# Altium schematic sheet LoRa_XCVR.SchDoc
size B
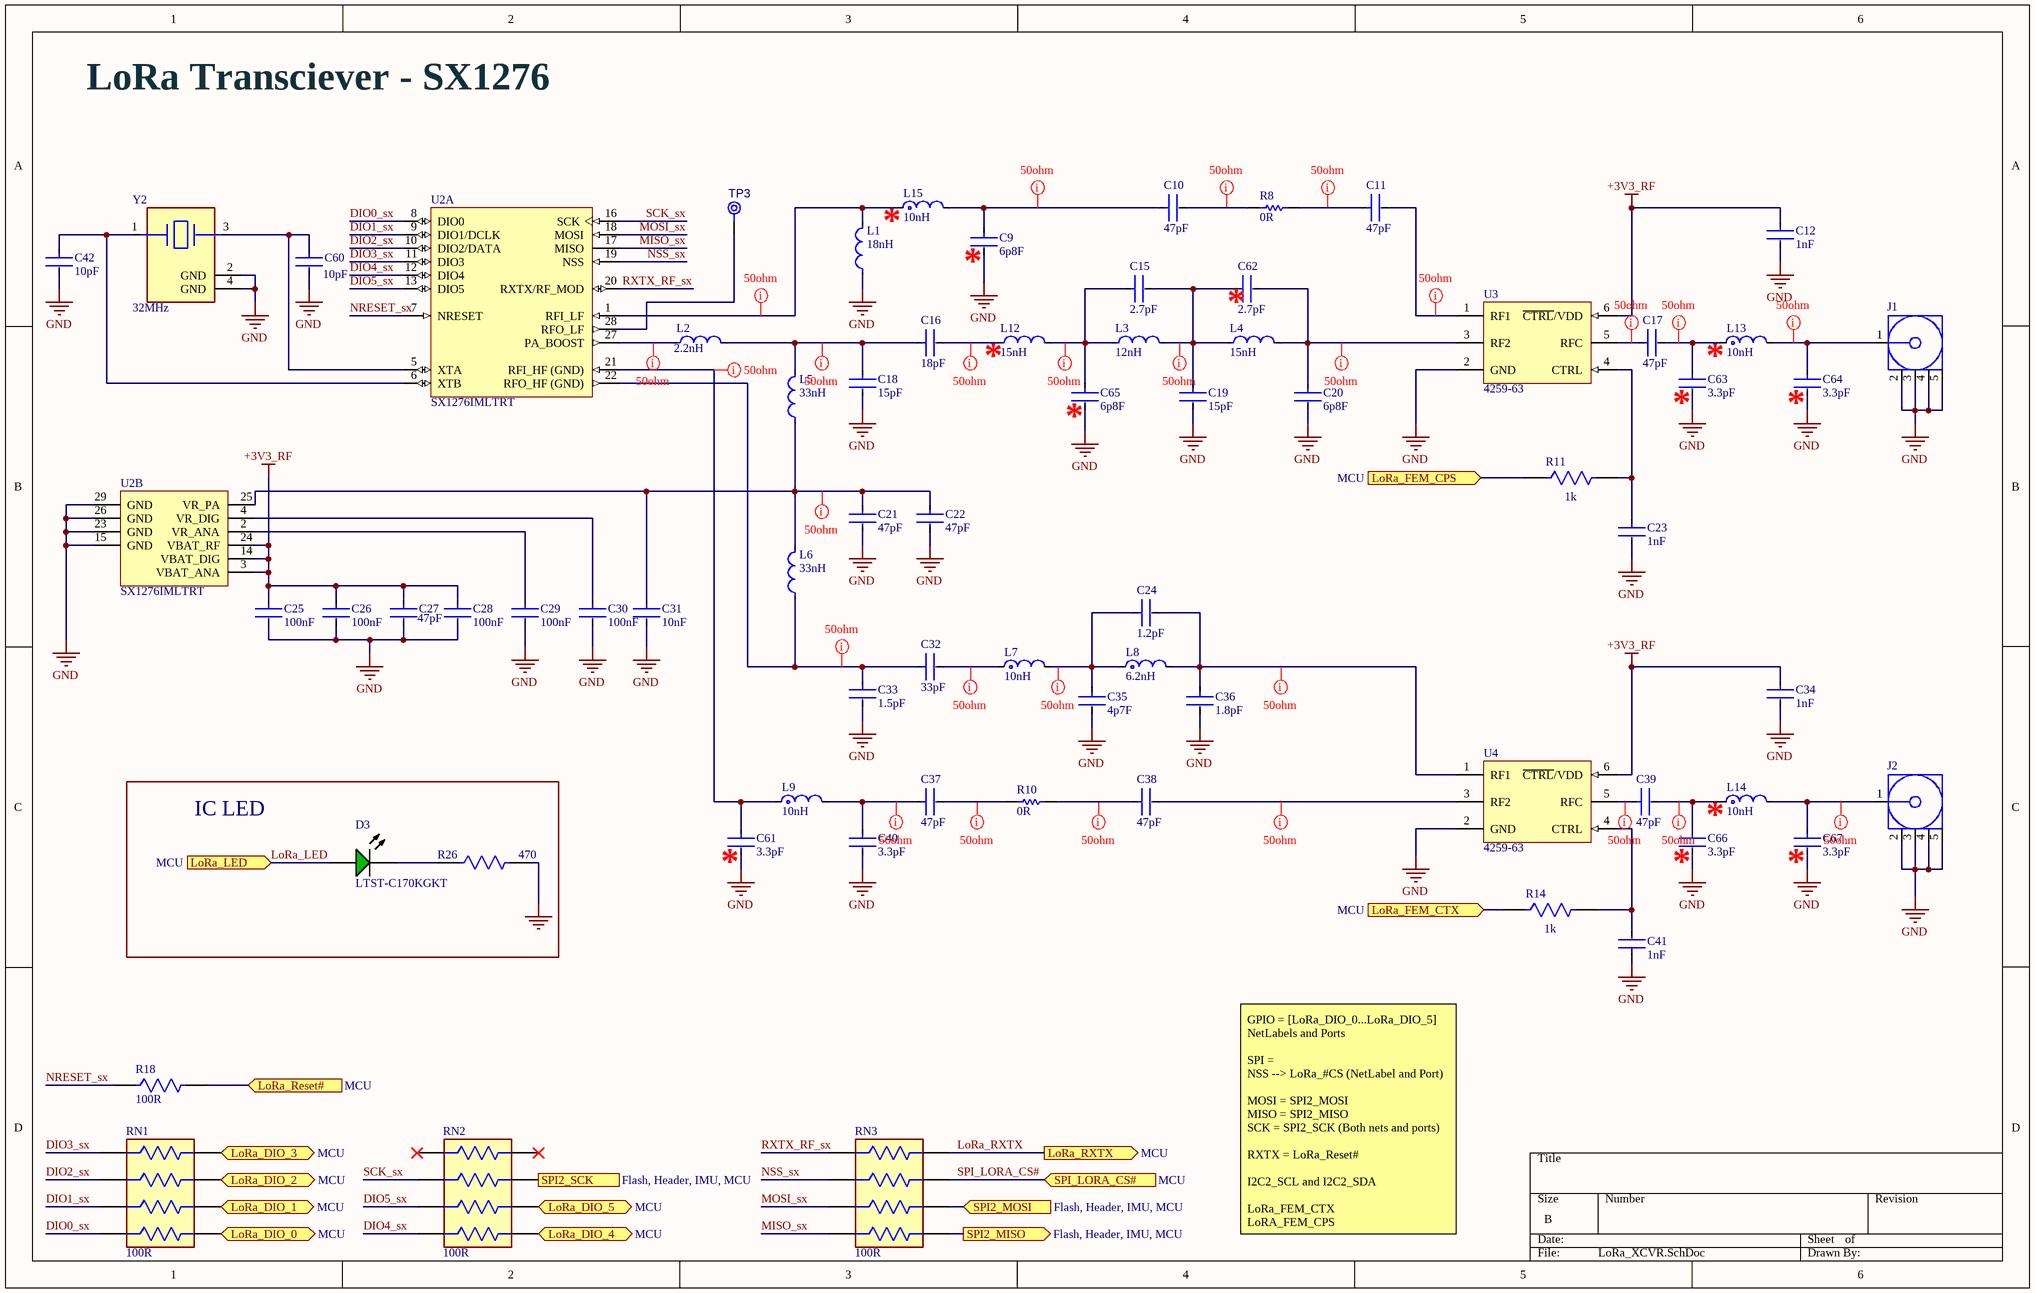
[diagram p0: LoRa_XCVR.SchDoc]

## Parts
C9  6p8F  [FP-GJM155-0_05-IPC_A]
C10  47pF  [FP-GJM155-0_05-MFG]
C11  47pF  [FP-GJM155-0_05-MFG]
C12  1nF  [FP-GRM155-0_05-IPC_C]
C15  2.7pF  [FP-GJM155-0_05-IPC_A]
C16  18pF  [FP-GJM155-0_05-IPC_B]
C17  47pF  [FP-GJM155-0_05-MFG]
C18  15pF  [FP-GJM155-0_05-IPC_A]
C19  15pF  [FP-GJM155-0_05-IPC_A]
C20  6p8F  [FP-GJM155-0_05-IPC_A]
C21  47pF  [FP-GJM155-0_05-MFG]
C22  47pF  [FP-GJM155-0_05-MFG]
C23  1nF  [FP-GRM155-0_05-IPC_C]
C24  1.2pF  [FP-GJM155-0_05-IPC_B]
C25  100nF  [FP-GRM155-0_05-IPC_B]
C26  100nF  [FP-GRM155-0_05-IPC_B]
C27  47pF  [FP-GJM155-0_05-MFG]
C28  100nF  [FP-GRM155-0_05-IPC_B]
C29  100nF  [FP-GRM155-0_05-IPC_B]
C30  100nF  [FP-GRM155-0_05-IPC_B]
C31  10nF  [FP-GRM155-0_05-IPC_C]
C32  33pF  [FP-GJM155-0_05-MFG]
C33  1.5pF  [FP-GJM155-0_05-IPC_C]
C34  1nF  [FP-GRM155-0_05-IPC_C]
C35  4p7F  [FP-GJM155-0_05-IPC_B]
C36  1.8pF  [FP-GJM155-0_05-IPC_B]
C37  47pF  [FP-GJM155-0_05-MFG]
C38  47pF  [FP-GJM155-0_05-MFG]
C39  47pF  [FP-GJM155-0_05-MFG]
C40  3.3pF  [FP-GJM155-0_05-IPC_C]
C41  1nF  [FP-GRM155-0_05-IPC_C]
C42  10pF  [FP-GRT155-0_05-MFG]
C60  10pF  [FP-GRT155-0_05-MFG]
C61  3.3pF  [FP-GJM155-0_05-IPC_C]
C62  2.7pF  [FP-GJM155-0_05-IPC_A]
C63  3.3pF  [FP-GJM155-0_05-IPC_C]
C64  3.3pF  [FP-GJM155-0_05-IPC_C]
C65  6p8F  [FP-GJM155-0_05-IPC_A]
C66  3.3pF  [FP-GJM155-0_05-IPC_C]
C67  3.3pF  [FP-GJM155-0_05-IPC_C]
D3  LTST-C170KGKT  [LTST-LTST-C170KGKT-2_V]
J1  142-0701-801  [CINC-142-0701-801_V]  (value not drawn)
J2  142-0701-801  [CINC-142-0701-801_V]  (value not drawn)
L1  18nH  [FP-LQW15AN_00-W0_6-0_1-MFG]
L2  2.2nH  [FP-LQW15AN_00-W0_6-0_1-MFG]
L3  12nH  [FP-LQW15AN_00-W0_6-0_1-MFG]
L4  15nH  [FP-LQW15AN_00-W0_6-0_1-MFG]
L5  33nH  [FP-LQW15AN_00-W0_5-0_1-MFG]
L6  33nH  [FP-LQW15AN_00-W0_5-0_1-MFG]
L7  10nH  [FP-LQG15HH_02-IPC_A]
L8  6.2nH  [FP-LQG15HH_02-IPC_C]
L9  10nH  [FP-LQG15HH_02-IPC_A]
L12  15nH  [FP-LQW15AN_00-W0_6-0_1-MFG]
L13  10nH  [FP-LQG15HH_02-IPC_A]
L14  10nH  [FP-LQG15HH_02-IPC_A]
L15  10nH  [FP-LQG15HH_02-IPC_A]
R8  0R  [RESC1005X40X25LL05T05]
R10  0R  [RESC1005X40X25LL05T05]
R11  1k  [FP-CRCW0402-e3-MFG]
R14  1k  [FP-CRCW0402-e3-MFG]
R18  100R  [FP-CRCW0402-e3-IPC_A]
R26  470  [FP-CPF0603-MFG]
RN1  100R  [FP-EXB38V-MFG]
RN2  100R  [FP-EXB38V-MFG]
RN3  100R  [FP-EXB38V-MFG]
TP3  TPAD6R  [TP06R]  (value not drawn)  (no BOM)
U2  SX1276IMLTRT  [SMTC-QFN-28_V]  (parts A,B of 2)
U3  4259-63  [PERE-SC-70-6_M]
U4  4259-63  [PERE-SC-70-6_M]
Y2  32MHz  [FP-ABM11-MFG]

## Blocks framed on the sheet
IC LED: D3 R26

## Ports
LoRa_DIO_0 (bidir, see MCU), LoRa_DIO_1 (bidir, see MCU), LoRa_DIO_2 (bidir, see MCU), LoRa_DIO_3 (bidir, see MCU), LoRa_DIO_4 (bidir, see MCU), LoRa_DIO_5 (bidir, see MCU), LoRa_FEM_CPS (in, see MCU), LoRa_FEM_CTX (in, see MCU), LoRa_LED (in, see MCU), LoRa_Reset# (in, see MCU), LoRa_RXTX (out, see MCU), SPI2_MISO (out, see Flash, Header, IMU, MCU), SPI2_MOSI (in, see Flash, Header, IMU, MCU), SPI2_SCK (in, see Flash, Header, IMU, MCU), SPI_LORA_CS# (in, see MCU)

## Nets
+3V3_RF: C12.1 C25.1 C26.1 C27.1 C28.1 C34.1 U2.3(VBAT_ANA) U2.14(VBAT_DIG) U2.24(VBAT_RF) U3.6(~{CTRL}/VDD) U4.6(~{CTRL}/VDD)
GND: C9.2 C12.2 C18.2 C19.2 C20.2 C21.2 C22.2 C23.2 C25.2 C26.2 C27.2 C28.2 C29.2 C30.2 C31.2 C33.2 C34.2 C35.2 C36.2 C40.2 C41.1 C42.2 C60.2 C61.2 C63.2 C64.2 C65.2 C66.2 C67.2 J1.2 J1.3 J1.4 J1.5 J2.2 J2.3 J2.4 J2.5 L1.1 R26.2 U2.15(GND) U2.23(GND) U2.26(GND) U2.29(GND) U3.2(GND) U4.2(GND) Y2.2(GND) Y2.4(GND)
DIO0_sx: RN1.4 U2.8(DIO0)
DIO1_sx: RN1.3 U2.9(DIO1/DCLK)
DIO2_sx: RN1.2 U2.10(DIO2/DATA)
DIO3_sx: RN1.1 U2.11(DIO3)
DIO4_sx: RN2.4 U2.12(DIO4)
DIO5_sx: RN2.3 U2.13(DIO5)
LoRa_DIO_0: RN1.5 ; port LoRa_DIO_0
LoRa_DIO_1: RN1.6 ; port LoRa_DIO_1
LoRa_DIO_2: RN1.7 ; port LoRa_DIO_2
LoRa_DIO_3: RN1.8 ; port LoRa_DIO_3
LoRa_DIO_4: RN2.5 ; port LoRa_DIO_4
LoRa_DIO_5: RN2.6 ; port LoRa_DIO_5
LoRa_FEM_CPS: R11.1 ; port LoRa_FEM_CPS
LoRa_FEM_CTX: R14.1 ; port LoRa_FEM_CTX
LoRa_LED: D3.2(A) ; port LoRa_LED
LoRa_Reset#: R18.2 ; port LoRa_Reset#
LoRa_RXTX: RN3.8 ; port LoRa_RXTX
MISO_sx: RN3.4 U2.17(MISO)
MOSI_sx: RN3.3 U2.18(MOSI)
NRESET_sx: R18.1 U2.7(NRESET)
NSS_sx: RN3.2 U2.19(NSS)
RXTX_RF_sx: RN3.1 U2.20(RXTX/RF_MOD)
SCK_sx: RN2.2 U2.16(SCK)
SPI2_MISO: RN3.5 ; port SPI2_MISO
SPI2_MOSI: RN3.6 ; port SPI2_MOSI
SPI2_SCK: RN2.7 ; port SPI2_SCK
SPI_LORA_CS#: RN3.7 ; port SPI_LORA_CS#
NetC9_1: C9.1 C10.1 L15.2
NetC10_2: C10.2 R8.1
NetC11_1: C11.1 R8.2
NetC11_2: C11.2 U3.1(RF1)
NetC15_1: C15.1 C65.1 L3.1 L12.2
NetC15_2: C15.2 C19.1 C62.1 L3.2 L4.1
NetC16_1: C16.1 C18.1 L2.2 L5.2
NetC16_2: C16.2 L12.1
NetC17_1: C17.1 U3.5(RFC)
NetC17_2: C17.2 C63.1 L13.1
NetC20_1: C20.1 C62.2 L4.2 U3.3(RF2)
NetC21_1: C21.1 C22.1 C31.1 L5.1 L6.2 U2.25(VR_PA)
NetC23_1: C23.1 R11.2 U3.4(CTRL)
NetC24_1: C24.1 C35.1 L7.2 L8.1
NetC24_2: C24.2 C36.1 L8.2 U4.1(RF1)
NetC29_1: C29.1 U2.2(VR_ANA)
NetC30_1: C30.1 U2.4(VR_DIG)
NetC32_1: C32.1 C33.1 L6.1 U2.22(RFO_HF_(GND))
NetC32_2: C32.2 L7.1
NetC37_1: C37.1 C40.1 L9.2
NetC37_2: C37.2 R10.1
NetC38_1: C38.1 R10.2
NetC38_2: C38.2 U4.3(RF2)
NetC39_1: C39.1 U4.5(RFC)
NetC39_2: C39.2 C66.1 L14.1
NetC41_2: C41.2 R14.2 U4.4(CTRL)
NetC42_1: C42.1 U2.6(XTB) Y2.1
NetC60_1: C60.1 U2.5(XTA) Y2.3
NetC61_1: C61.1 L9.1 U2.21(RFI_HF_(GND))
NetC64_1: C64.1 J1.1 L13.2
NetC67_1: C67.1 J2.1 L14.2
NetD3_1: D3.1(K) R26.1
NetL1_2: L1.2 L15.1 U2.1(RFI_LF)
NetL2_1: L2.1 U2.27(PA_BOOST)
NetTP3_1: TP3.1(TP) U2.28(RFO_LF)

Not connected (* = marked no-connect by the designer): RN2 1* 8*

## Layout directives
net class 50ohm: NetC9_1, NetC10_2, NetC11_1, NetC11_2, NetC15_1, NetC15_2, NetC16_1, NetC16_2, NetC17_1, NetC17_2, NetC20_1, NetC21_1, NetC24_1, NetC24_2, NetC32_1, NetC32_2, NetC37_1, NetC37_2, NetC38_1, NetC38_2, NetC39_1, NetC39_2, NetC61_1, NetC64_1, NetC67_1, NetL1_2, NetL2_1

## Notes on the sheet
- LoRa Transciever - SX1276
- (near L15) *
- (near C9) *
- (near L12) *
- (near C62) *
- (near L13) *
- (near C65) *
- (near C63) *
- (near C64) *
- (near L14) *
- (near C61) *
- (near C66) *
- (near C67) *
- GPIO = [LoRa_DIO_0...LoRa_DIO_5] NetLabels and Ports
  SPI =
  NSS --> LoRa_#CS (NetLabel and Port)
  MOSI = SPI2_MOSI
  MISO = SPI2_MISO
  SCK = SPI2_SCK (Both nets and ports)
  RXTX = LoRa_Reset#
  I2C2_SCL and I2C2_SDA
  LoRa_FEM_CTX
  LoRA_FEM_CPS

## Library data of the parts
C9 C20 C65 = CMP-2008-03772-2: Multi-Layer Ceramic Capacitor 6.8pF C0G  ±0.1pF 0402 Paper T/R; Voltage Rating (DC): 50V; Dielectric: C0G; Mount: Surface Mount; Packaging: Tape and Reel; Capacitance: 6.8pF; Length: 1mm; Height: 0.5mm; Depth: 0.5mm; Thickness: 0.022inch; Max Operating Temperature: 125°C; Package Quantity: 10000; Width: 0.02inch; Case Code (Metric): 1005; Lead Free: Lead Free; Termination: SMD/SMT; Case Code (Imperial): 0402; Radiation Hardening: No; Case/Package: 0402; Voltage Rating: 50V; Min Operating Temperature: -55°C
C10 C11 C17 C21 C22 C27 C37-C39 = CMP-06035-013708-1: Multi-Layer Ceramic Capacitor 47pF C0G  ±5% 0402 Paper T/R; Voltage Rating (DC): 50V; Capacitance: 47pF; Tolerance: 5%; Dielectric: C0G; Thickness: 500um; Length: 1mm; Width: 500um
C12 C23 C34 C41 = CMP-1034-01633-3: Chip Multilayer Ceramic Capacitors for General Purpose, 0402, 1000pF, X7R, 15%, 10%, 100V; Width: 0.5mm; Radiation Hardening: No; Min Operating Temperature: -55°C; Lead Free: Lead Free; Voltage Rating: 100V; Max Operating Temperature: 125°C; Case Code (Imperial): 0402; Case/Package: 0402; Depth: 0.5mm; Case Code (Metric): 1005; Capacitance: 1nF; Height: 0.5mm; Termination: SMD/SMT; Thickness: 0.022inch; Material: Ceramic; Dielectric: X7R; Package Quantity: 10000; Tolerance: 10%; Packaging: Tape and Reel; Length: 1mm; REACH SVHC: No SVHC; Voltage: 100V; Mount: Surface Mount; Voltage Rating (DC): 100V
C15 C62 = CMP-2008-03840-2: Multi-Layer Ceramic Capacitor 2.7pF C0G  ±0.1pF 0402 Paper T/R; Voltage Rating (DC): 50V; Temperature Coefficient: 30ppm/°C; Max Operating Temperature: 125°C; Lead Free: Lead Free; REACH SVHC: No SVHC; Thickness: 0.022inch; Length: 1mm; Height: 0.5mm; Min Operating Temperature: -55°C; Mount: Surface Mount; Case/Package: 0402; Case Code (Imperial): 0402; Width: 0.02inch; Capacitance: 2.7pF; Packaging: Tape and Reel; Package Quantity: 10000; Lead Pitch: 0.3mm; Dielectric: C0G; Depth: 0.5mm; Voltage Rating: 50V; Radiation Hardening: No; Termination: SMD/SMT; Voltage: 50V; Number of Pins: 2; Case Code (Metric): 1005
C16 = CMP-2008-03807-2: Multi-Layer Ceramic Capacitor 18pF C0G  ±5% 0402 Paper T/R; Voltage: 50V; Radiation Hardening: No; Capacitance: 18pF; Depth: 0.5mm; Voltage Rating: 50V; Case/Package: 0402; Tolerance: 5%; Packaging: Tape and Reel; Height: 0.5mm; Case Code (Imperial): 0402; Width: 0.02inch; Lead Free: Lead Free; Dielectric: C0G; Package Quantity: 1; Max Operating Temperature: 125°C; Thickness: 0.022inch; Termination: SMD/SMT; Length: 1mm; Min Operating Temperature: -55°C; Mount: Surface Mount; Voltage Rating (DC): 50V; Case Code (Metric): 1005
C18 C19 = CMP-2008-03804-2: Multi-Layer Ceramic Capacitor 15pF C0G  ±5% 0402 Paper T/R; Voltage Rating (DC): 50V; Temperature Coefficient: 30ppm/°C; Dielectric: C0G; Max Operating Temperature: 125°C; Radiation Hardening: No; REACH SVHC: No SVHC; Case Code (Imperial): 0402; Package Quantity: 1; Thickness: 0.022inch; Min Operating Temperature: -55°C; Mount: Surface Mount; Tolerance: 5%; Voltage Rating: 50V; Depth: 0.5mm; Width: 0.02inch; Height: 0.5mm; Number of Pins: 2; Case Code (Metric): 1005; Lead Pitch: 0.3mm; Case/Package: 0402; Termination: SMD/SMT; Voltage: 50V; Length: 1mm; Capacitance: 15pF; Packaging: Tape and Reel; Lead Free: Lead Free
C24 = CMP-2008-03813-2: Multi-Layer Ceramic Capacitor 1.2pF C0G  ±0.1pF 0402 Paper T/R; Voltage Rating (DC): 50V; Temperature Coefficient: 30ppm/°C; Case Code (Metric): 1005; Lead Free: Lead Free; Packaging: Tape and Reel; Radiation Hardening: No; Dielectric: C0G; Case Code (Imperial): 0402; Weight: 2.3E-05oz; Width: 0.5mm; Case/Package: 0402; Length: 1mm; Voltage Rating: 50V; Number of Pins: 2; Depth: 0.5mm; Thickness: 0.022inch; Voltage: 50V; Package Quantity: 10000; Max Operating Temperature: 125°C; Height: 0.5mm; REACH SVHC: No SVHC; Capacitance: 1.2pF; Mount: Surface Mount; Min Operating Temperature: -55°C; Termination: SMD/SMT; Lead Pitch: 0.3mm
C25 C26 C28-C30 = CMP-2008-04639-2: Chip Multilayer Ceramic Capacitors for General Purpose, 0402, 0.10uF, X7R, 15%, 10%, 50V; Dissipation Factor: 0.025%; Weight: 0.000212oz; Thickness: 0.022inch; Voltage Rating (DC): 50V; Dielectric Material: Ceramic; Termination: SMD/SMT; Case/Package: 0402; Case Code (Imperial): 0402; Mount: Surface Mount; REACH SVHC: No SVHC; Resistor Type: Ceramic; Dielectric: X7R; Max Operating Temperature: 125°C; Voltage: 50V; Lead Free: Lead Free; Package Quantity: 10000; Packaging: Tape and Reel; Capacitance: 100nF; Length: 1mm; Material: Ceramic; Height: 0.5mm; Depth: 0.5mm; Width: 0.5mm; Min Operating Temperature: -55°C; Tolerance: 10%; Case Code (Metric): 1005; Voltage Rating: 50V
C31 = CMP-2008-04637-5: Chip Multilayer Ceramic Capacitors for General Purpose, 0402, 10000pF, X7R, 15%, 10%, 50V; Voltage: 25V; Tolerance: 10%; Mount: Surface Mount; Lead Free: Lead Free; Radiation Hardening: No; Case Code (Imperial): 0402; REACH SVHC: No SVHC; Case/Package: 0402; Dielectric: X7R; Voltage Rating (DC): 50V; Max Operating Temperature: 125°C; Termination: SMD/SMT; Material: Ceramic; Width: 0.02inch; Package Quantity: 1; Voltage Rating: 50V; Thickness: 0.022inch; Packaging: Tape and Reel; Height: 0.5mm; Number of Pins: 2; Case Code (Metric): 1005; Min Operating Temperature: -55°C; Length: 1mm; Capacitance: 10nF; Depth: 0.5mm
C32 = CMP-06035-057988-1: Multi-Layer Ceramic Capacitor 33pF C0G  ±5% 0402 Paper T/R; Voltage Rating (DC): 50V; Width: 500um; Capacitance: 33pF; Dielectric: C0G; Length: 1mm; Thickness: 500um; Tolerance: 5%
C33 = CMP-2008-03820-2: Multi-Layer Ceramic Capacitor 1.5pF C0G  ±0.1pF 0402 Paper T/R; Temperature Coefficient: 30ppm/°C; Voltage Rating: 50V; Depth: 0.5mm; Case Code (Imperial): 0402; Package Quantity: 10000; Length: 1mm; Number of Pins: 2; Max Operating Temperature: 125°C; Mount: Surface Mount; Construction: Flat; Thickness: 0.022inch; Series: GJM; Packaging: Tape and Reel; Radiation Hardening: No; REACH SVHC: No SVHC; Case/Package: 0402; Lead Free: Lead Free; Voltage Rating (DC): 50V; Min Operating Temperature: -55°C; Dielectric: C0G; Termination: SMD/SMT; Width: 0.5mm; Capacitance: 1.5pF; Lead Pitch: 0.3mm; Case Code (Metric): 1005; Voltage: 50V; Height: 0.5mm
C35 = CMP-2008-03859-2: Multi-Layer Ceramic Capacitor 4.7pF C0G  ±0.25pF 0402 Paper T/R; Voltage Rating (DC): 50V; Temperature Coefficient: 30ppm/°C; Case/Package: 0402; Packaging: Tape and Reel; Package Quantity: 10000; Depth: 0.5mm; REACH SVHC: No SVHC; Height: 0.5mm; Lead Free: Lead Free; Number of Pins: 2; Case Code (Imperial): 0402; Width: 0.02inch; Max Operating Temperature: 125°C; Capacitance: 4.7pF; Dielectric: C0G; Lead Pitch: 0.3mm; Voltage Rating: 50V; Min Operating Temperature: -55°C; Thickness: 0.022inch; Voltage: 50V; Radiation Hardening: No; Mount: Surface Mount; Termination: SMD/SMT; Case Code (Metric): 1005; Length: 1mm
C36 = CMP-2008-03825-2: Multi-Layer Ceramic Capacitor 1.8pF C0G  ±0.1pF 0402 Paper T/R; Voltage: 50V; Dielectric: C0G; Number of Pins: 2; Depth: 0.5mm; Case Code (Imperial): 0402; Max Operating Temperature: 125°C; Radiation Hardening: No; Width: 0.5mm; Thickness: 0.022inch; REACH SVHC: No SVHC; Mount: Surface Mount; Voltage Rating (DC): 50V; Case/Package: 0402; Length: 1mm; Case Code (Metric): 1005; Capacitance: 1.8pF; Packaging: Tape and Reel; Min Operating Temperature: -55°C; Termination: SMD/SMT; Lead Pitch: 0.3mm; Lead Free: Lead Free; Voltage Rating: 50V; Height: 0.5mm; Package Quantity: 10000
C40 C61 C63 C64 C66 C67 = CMP-2008-03846-2: Multi-Layer Ceramic Capacitor 3.3pF C0G  ±0.1pF 0402 Paper T/R; Voltage: 50V; Lead Free: Lead Free; Thickness: 0.022inch; Mount: Surface Mount; Termination: SMD/SMT; Package Quantity: 1; Lead Pitch: 0.3mm; Case/Package: 0402; REACH SVHC: No SVHC; Case Code (Imperial): 0402; Number of Pins: 2; Height: 0.5mm; Width: 0.5mm; Depth: 0.5mm; Capacitance: 3.3pF; Packaging: Tape and Reel; Min Operating Temperature: -55°C; Length: 1mm; Dielectric: C0G; Case Code (Metric): 1005; Max Operating Temperature: 125°C; Voltage Rating (DC): 50V; Voltage Rating: 50V; Radiation Hardening: No
C42 C60 = CMP-06035-051459-1: Multi-Layer Ceramic Capacitor 10pF 50V C0G ±5% 0402 Paper T/R
D3 = CMP-2000-06620-1: Ultra Bright AlInGaP Chip LED, 75 mW, -55 to 85 degC, 2-Pin SMD (0805), RoHS, Tape and Reel; Manufacturer: Lite-On; Forward Current: 30mA; Power Dissipation Max: 75mW; Emitting Color: YellowGreen; Type: Uni-Color; Forward Voltage: 2.4V; Dominant Wave Length: 571nm; Test Current (It): 20mA; Product Length (mm): 2mm; Peak Wavelength: 574nm; Power Dissipation: 75W; Product Depth (mm): 1.25mm; DELETED: Compliant; High Brightness: Yes; Product Height (mm): 1.1mm; Luminous Intensity: 35mcd; Shape Type: Rectangular; Chip Material: AlGaInP; Viewing Angle: 130deg; Number of  Elements: 1; Reverse Voltage: 5V; Rad Hardened: No; Package Type: ChipLed; Manufacturer URL: http://www.us.liteon.com/; Mounting: SurfaceMount; Operating Temp Range: -55Cto85C; Datasheet URL: http://optoelectronics.liteon.com/upload/download/DS22-2000-073/S_110_LTST-C170KGKT.pdf; Packaging: TapeandReel; Pin Count: 2; Package Description: 2-Pin Surface Mounted Device, Body 2 x 1.25 mm; Mounting Technology: SurfaceMount; Package Reference: LTST-C170KGKT-2; Forward Current Max: 30mA; Datasheet Version: Rev. G, 06/2005; Lens Dimensions: 1.4x1.25x0.6mm; Operating Temperature Classification: Industrial; Lum Intensity: 35mcd; Main Category: ChipLED
J1 J2 = CMP-2000-05490-1: SMA End Launch Jack Receptacle, 50 Ohm, 0 to 18 GHz, -65 to 165 degC, 5-Pin SMD, RoHS, Bulk; Manufacturer: EmersonConnectivitySolutions; Connector Type: JackPCB; Gender: Jack(Female); Impedance: 50Ohms; Brand: Johnson/EmersonConnectivitySolutions; Body Material: Brass; Body Style: Straight; Maximum Frequency: 18GHz; Factory Pack Quantity: 5; Datasheet URL: https://belfuse.com/resources/Johnson/productinformation/pi-142-0701-801.pdf; Datasheet Version: 12/2014; Operating Temperature Range: -65Cto+165C; Mounting Technology: SurfaceMount; RF Series: SMA; Package Reference: 142-0701-801; Product Category: RFConnectors/CoaxialConnectors; Termination Style: Solder; RoHS: Details; Package URL: https://belfuse.com/resources/Johnson/drawings/dr-1420701801.pdf; Series: SMA; Package Description: 5-Pin Surface Mount Device, Body 14.275 x 9.525 mm; Manufacturer URL: http://www.cinch.com/; Contact Plating: Gold; Product: Connectors; Orientation: Straight
L1 = CMP-06042-006916-1: Wire Wound RF Inductor 18nH ±5% 370mA 0.27Ω 0402 (1005); Q Factor: 25; DC Resistance (DCR): 270mR; Test Frequency: 100MHz; Self Resonant Frequency: 4.5GHz; Core Material: Air; Shielding: Unshielded; Inductance: 18nH; Lead Free: Lead Free; Resistor Type: Wirewound; Height: 0.5mm; Width: 0.02inch; Max DC Current: 370mA; Case/Package: 0402; Radiation Hardening: No; Min Operating Temperature: -55°C; Packaging: Tape and Reel; DC Current: 370mA; Tolerance: 5%; Max Operating Temperature: 125°C; Weight: 2.8E-05oz; Current Rating: 370mA; Military Standard: Not; Termination: SMD/SMT; Length: 1mm; Case Code (Metric): 1005; Mount: Surface Mount; Case Code (Imperial): 0402; Package Quantity: 10000; Depth: 0.7mm
L2 = CMP-06042-008786-1: Wire Wound RF Inductor 2.2nH ±0.2nH 1000mA 0.027Ω 0402 (1005); Q Factor: 25; Current Rating: 1A; Core Material: Air; Test Frequency: 100MHz; Shielding: Unshielded; DC Resistance (DCR): 27mR; Self Resonant Frequency: 14GHz; Min Operating Temperature: -55°C; Package Quantity: 10000; Length: 1mm; Number of Pins: 2; Radiation Hardening: No; Case Code (Metric): 1005; Termination: SMD/SMT; Inductance: 2.2nH; Mount: Surface Mount; DC Current: 1A; Military Standard: Not; Max Operating Temperature: 125°C; Max DC Current: 1A; Lead Free: Lead Free; Depth: 0.7mm; Case/Package: 0402; Packaging: Tape and Reel; Height: 0.5mm; Width: 0.5mm; REACH SVHC: No SVHC; Weight: 2.8E-05oz; Case Code (Imperial): 0402
L3 = CMP-06042-005424-1: Wire Wound RF Inductor 12nH ±5% 500mA 0.14Ω 0402 (1005); Shielding: Unshielded; Self Resonant Frequency: 5.5GHz; Core Material: Air; Test Frequency: 100MHz; Q Factor: 30; DC Resistance (DCR): 140mR; DC Current: 500mA; Case/Package: 0402; Max DC Current: 500mA; Current Rating: 500mA; Mount: Surface Mount; Case Code (Metric): 1005; Military Standard: Not; Inductance: 12nH; Min Operating Temperature: -55°C; Packaging: Tape and Reel; Radiation Hardening: No; Package Quantity: 10000; Max Operating Temperature: 125°C; Resistor Type: Wirewound; Case Code (Imperial): 0402; Tolerance: 5%; Lead Free: Lead Free; Termination: SMD/SMT; Length: 1.1mm; Height: 0.02inch; Depth: 0.7mm; Weight: 2.8E-05oz; Width: 0.5mm
L4 L12 = CMP-2000-06595-2: Wire Wound RF Inductor 15nH ±5% 460mA 0.16Ω 0402 (1005); Test Frequency: 100MHz; DC Resistance (DCR): 160mR; Shielding: Unshielded; Q Factor: 30; Core Material: Air; Self Resonant Frequency: 5GHz; Resistor Type: Wirewound; DC Current: 460mA; Inductance: 15nH; Weight: 2.8E-05oz; Radiation Hardening: No; Depth: 0.7mm; Package Quantity: 10000; Case/Package: 0402; Packaging: Tape and Reel; Length: 1mm; Max DC Current: 460mA; Case Code (Imperial): 0402; Tolerance: 5%; Min Operating Temperature: -55°C; Lead Free: Lead Free; Width: 0.02inch; Case Code (Metric): 1005; Termination: SMD/SMT; Military Standard: Not; Current Rating: 460mA; Height: 0.5mm; Mount: Surface Mount; Max Operating Temperature: 125°C
L5 L6 = CMP-06042-007456-1: Wire Wound RF Inductor 33nH ±5% 260mA 0.63Ω 0402 (1005); Test Frequency: 100MHz; Core Material: Air; Shielding: Unshielded; Q Factor: 25; Self Resonant Frequency: 3.2GHz; DC Resistance (DCR): 630mR; Width: 0.5mm; Tolerance: 5%; Case Code (Imperial): 0402; Max Operating Temperature: 125°C; Inductance: 33nH; Weight: 2.8E-05oz; Case Code (Metric): 1005; Lead Free: Lead Free; Case/Package: 0402; Max DC Current: 260mA; Military Standard: Not; Length: 1mm; Packaging: Tape and Reel; Mount: Surface Mount; Package Quantity: 10000; Min Operating Temperature: -55°C; Resistor Type: Wirewound; Radiation Hardening: No; Height: 0.5mm; Termination: SMD/SMT; DC Current: 260mA; Current Rating: 260mA; Depth: 0.6mm
L7 L9 L13-L15 = CMP-06042-014117-1: Multilayer type RF Inductor 10nH ±5% 0.26Ω 500mA 0402; DC Resistance (DCR): 260mR; DC Current: 300mA; Shielding: Unshielded; Q Factor: 8; Test Frequency: 100MHz; Self Resonant Frequency: 3.4GHz; Core Material: Air; Width: 0.5mm; Radiation Hardening: No; Packaging: Tape and Reel; Lead Free: Lead Free; Military Standard: Not; Case/Package: 0402; Current Rating: 300mA; Case Code (Metric): 1005; Length: 0.039inch; Termination: SMD/SMT; Max DC Current: 300mA; Max Operating Temperature: 125°C; Mount: Surface Mount; Height - Seated (Max): 0.022inch; Package Quantity: 10000; Height: 0.5mm; Inductance: 10nH; Tolerance: 5%; Case Code (Imperial): 0402; Depth: 0.55mm; Min Operating Temperature: -55°C
L8 = CMP-06042-008294-1: Multilayer type RF Inductor 6.2nH ±0.3nH 0.2Ω 600mA 0402; Current Rating: 300mA; DC Resistance (DCR): 220mR; Shielding: Unshielded; Q Factor: 8; Test Frequency: 100MHz; Core Material: Air; Self Resonant Frequency: 4.5GHz; Width: 0.02inch; Length: 1mm; Height - Seated (Max): 0.022inch; Inductance: 6.2nH; Min Operating Temperature: -55°C; Case Code (Imperial): 0402; Case/Package: 0402; Termination: SMD/SMT; Max Operating Temperature: 125°C; Package Quantity: 10000; Depth: 0.55mm; Radiation Hardening: No; Lead Free: Lead Free; Packaging: Tape and Reel; Max DC Current: 300mA; Height: 0.5mm; Mount: Surface Mount; Military Standard: Not; Case Code (Metric): 1005; DC Current: 300mA
R8 R10 = CMP-2000-07451-1: Chip Resistor, 0 Ohm, 0.1 W, -55 to 155 degC, 0402 (1005 Metric), RoHS, Tape and Reel; Manufacturer: Panasonic; Voltage Rating (DC): 50V; Temperature Coefficient: 600ppm/��C; Max Power Dissipation: 100mW; Resistance: 0mOhm; Tolerance: 5%; Number of Terminations: 2; Mount: SurfaceMount; Height: 0.35mm; Packaging: TapeandReel; Contact Plating: Tin; Manufacturer URL: http://www.panasonic.com/; Composition: ThickFilm; Max Operating Temperature: 155degC; REACH SVHC: NoSVHC; Case/Package: 0402; Package Reference: 402; Depth: 0.5mm; Package Description: 2-Pin Surface Mount Device, Body 1 x 0.5 mm; Datasheet URL: https://industrial.panasonic.com/cdbs/www-data/pdf/RDA0000/AOA0000C301.pdf; RoHSCompliant: True; Case Code (Imperial): 0402; Military Standard: Not; Min Operating Temperature: -55degC; Power Rating: 100mW; Datasheet Version: 03/2015; Length: 1mm; Case Code (Metric): 1005; Termination: SMD/SMT; Mounting Technology: SurfaceMount; Voltage Rating: 50V; Width: 0.02inch; Package Quantity: 1; Lead Free: LeadFree; Radiation Hardening: No
R11 R14 = CMP-1011-00074-3: RES Thick Film, 1kΩ, 5%, 0.063W, 200ppm/°C, 0402; Voltage Rating: 50V; Max Power Dissipation: 63mW; Resistance: 1kR; Tolerance: 5%; Military Standard: Not; Height: 0.016inch; Depth: 0.5mm; Width: 0.5mm; Radiation Hardening: No; Length: 1mm; Min Operating Temperature: -55°C; Max Operating Temperature: 155°C; Composition: Thick Film; Working Voltage: 50V; Packaging: Tape and Reel; Contact Plating: Tin; Temperature Coefficient: 200ppm/°C; Termination: SMD/SMT; Case/Package: 0402; Number of Terminations: 2; Mount: Surface Mount; Power Rating: 63mW; Package Quantity: 1; Case Code (Imperial): 0402; Number of Pins: 2; Features: Automotive AEC-Q200; Case Code (Metric): 1005; Weight: 2.3E-05oz
R18 = CMP-2002-08129-2: RES Thick Film, 100Ω, 5%, 0.063W, 200ppm/°C, 0402; Working Voltage: 50V; Max Power Dissipation: 63mW; Termination: SMD/SMT; Features: Automotive AEC-Q200; Radiation Hardening: No; Resistance: 100R; Contact Plating: Tin; Military Standard: Not; Case Code (Metric): 1005; Max Operating Temperature: 155°C; Width: 0.02inch; Number of Terminations: 2; Case/Package: 0402; Height: 0.016inch; Voltage Rating: 50V; Tolerance: 5%; Mount: Surface Mount; Composition: Thick Film; Length: 1mm; Power Rating: 63mW; Case Code (Imperial): 0402; Temperature Coefficient: 200ppm/°C; Min Operating Temperature: -55°C; Weight: 2.3E-05oz; Depth: 0.5mm; Package Quantity: 10000; Packaging: Tape and Reel
R26 = CMP-03211-004765-1: RES SMD 470Ω 0.1% 1/16W 0603 / CPF0603B470RE; Manufacturer: TE Connectivity; Temperature Coefficient: 25ppm/°C; Voltage Rating: 50V; Power Rating: 0.063W; Value: 470Ω; Device Class L3: Chip SMD Resistors; RoHS: TRUE; Category: Res; Device Class L2: Resistors; Series: CPF; Height: 0.55mm; Temperature: -55°C to +155°C; Temperature Range High: +155°C; Automotive: No; octopart_url: https://octopart.com/cpf0603b470re-te+connectivity-23376607; packaging: 5k Reel; ComponentLink2Description: Datasheet; Temperature Range Low: -55°C; Device Class L1: Passive Components; Ipc Land Pattern Name: RESC15580X45; Package: CPF0603; Composition: Thin Film; Manufacturer Part Number: CPF0603B470RE; Resistance: 470Ω; Octopart: https://octopart.com/cpf0603b470re-te+connectivity-23376607; Lead Free: Yes; ComponentLink2URL: https://www.te.com/commerce/DocumentDelivery/DDEController?Action=showdoc&DocId=Data+Sheet%7F1773200%7FM%7Fpdf%7FEnglish%7FENG_DS_1773200_M.pdf%7F3-1676481-2; Tolerance: 0.1%
RN1-RN3 = CMP-05421-000004-1: RES ARRAY 4 RES 100 OHM 1206; Number of Resistors: 4; Number of Terminals/Pins: 8; Voltage Rating: 50V; Resistance Tolerance: 5%; Voltage Rating (DC): 100V; Power Per Element: 62.5mW; Temperature Coefficient: 200ppm/°C; Circuit Type: Isolated; Resistance: 100R; Case Code (Metric): 3216; Max Operating Temperature: 125°C; Termination: Convex; Depth: 1.6mm; Number of Elements: 4; Mount: Surface Mount; Radiation Hardening: No; Case/Package: 1206; Number of Pins: 8; Package Quantity: 1; Contact Plating: Tin; Length: 3.2mm; REACH SVHC: No SVHC; Case Code (Imperial): 1206; Number of Contacts: 8; RoHS Compliant: Yes; Series: EXB; Terminal Pitch: 0.8mm; Tolerance: 5%; Technology: THICK FILM; Height: 0.5mm; Packaging: Tape and Reel; Military Standard: Not; Min Operating Temperature: -55°C; Width: 0.063inch; Lead Free: Lead Free
TP3 = CMP-00028-00002-2: 0.6mm round; Pins: 1
U2 = CMP-2000-05356-1: Low Power Long Range Transceiver, 137 to 1020 MHz, -40 to 85 degC, 28-Pin QFN, RoHS, Tape and Reel; Manufacturer: Semtech; Power - Output: 20dBm; Data Rate (Max): 300kbps; Sensitivity: -148dBm; Featured Product: SX1276LongRangeTransceiver; PCN Design/Specification: CopperWire25/Mar/2014; GPIO: 6; Frequency: 137MHz~1.02GHz; Voltage - Supply: 1.8V~3.7V; Protocol: LoRa™; Current - Transmitting: 20mA~120mA; Current - Receiving: 10.8mA~12mA; Online Catalog: SX1276,SX1277andSX1278; Design Resources: SX127xReferenceDesignOverviewDevelopmentToolSelector; Serial Interfaces: SPI; Mfg Application Notes: LoRaModulation:CrystalOscillatorGuidanceSX12xxSoftwareImplementationofDataWhiteningandCRCSX127xLoRaLowEnergyDesignGuideSX127xLoRaModemDesignersGuide; Modulation: FSK,GFSK,GMSK,MSK,OOK; Other Names: SX1276IMLTRTTR; Series: -; Manufacturer URL: http://www.semtech.com/; Datasheet URL: http://www.semtech.com/images/datasheet/sx1276.pdf; Type: TxRx+MCU; RF Family/Standard: 802.15.4; Package Reference: QFN-28; Standard Package: 3,000; Package Description: 28-Pin Quad Flat No-lead Package, Body 6 x 6 mm, Pitch 0.65 mm; Category: RF/IFandRFID; Operating Temperature: -40degC~85degC; Datasheet Version: Rev. 4, 03/2015; Memory Size: -; Family: RFTransceiverICs; Packaging: Tape&Reel(TR); Package / Case: 28-VQFNExposedPad
U3 U4 = CMP-2000-05298-1: IC RF Switch SPDT, 50 Ohm, 6-Pin SC70, RoHS, Tape and Reel; Manufacturer: Peregrine Semiconductor; P1dB: 29dBm(typ)IP1dB; Topology: Reflective; Frequency - Upper: 3GHz; Insertion Loss @ Frequency: 0.5dB@2GHz; IIP3: 55dBm(typ); Voltage - Supply: 1.8V~3.3V; Other Names: 1046-1011-24259-63-ND425963PE4259PE4259SCBC-ZPE4259SCBC-Z-ND; Isolation @ Frequency: 20dB@2GHz(typ); Frequency - Lower: 10MHz; Online Catalog: PE4259; Impedance: 50Ohm; RF Type: GeneralPurpose; Series: UltraCMOS; Manufacturer URL: http://www.psemi.com/; Package Description: 6-Pin Small Outline Transistor, Body 2.05 x 1.25 mm, Pitch 0.65 mm; Family: RFSwitches; Packaging: Tape&Reel(TR); Features: Single/DualLineControl; Package / Case: 6-TSSOP,SC-88,SOT-363; Operating Temperature: -40degC~85degC; Circuit: SPDT; Supplier Device Package: SC-70-6; Standard Package: 3,000; Datasheet URL: https://datasheet.ciiva.com/15100/getdatasheetpartid-685660-15100501.pdf; Category: RF/IFandRFID; Datasheet Version: Jan-11; Package Reference: SC-70-6
Y2 = CMP-27762-009665-1: Crystal 32MHz ±10ppm 10pF SMD-4 2mm x 1.6mm; ESR (Equivalent Series Resistance): 80R; Frequency: 32MHz; Mount: Surface Mount; Load Capacitance: 10pF; Frequency Tolerance: 10ppm; Case/Package: SMD/SMT; Packaging: Tape and Reel; Max Operating Temperature: 70°C; Min Operating Temperature: -20°C; Frequency Stability: 10ppm